# EAGLE schematic M182B (EAGLE 6.6.0)
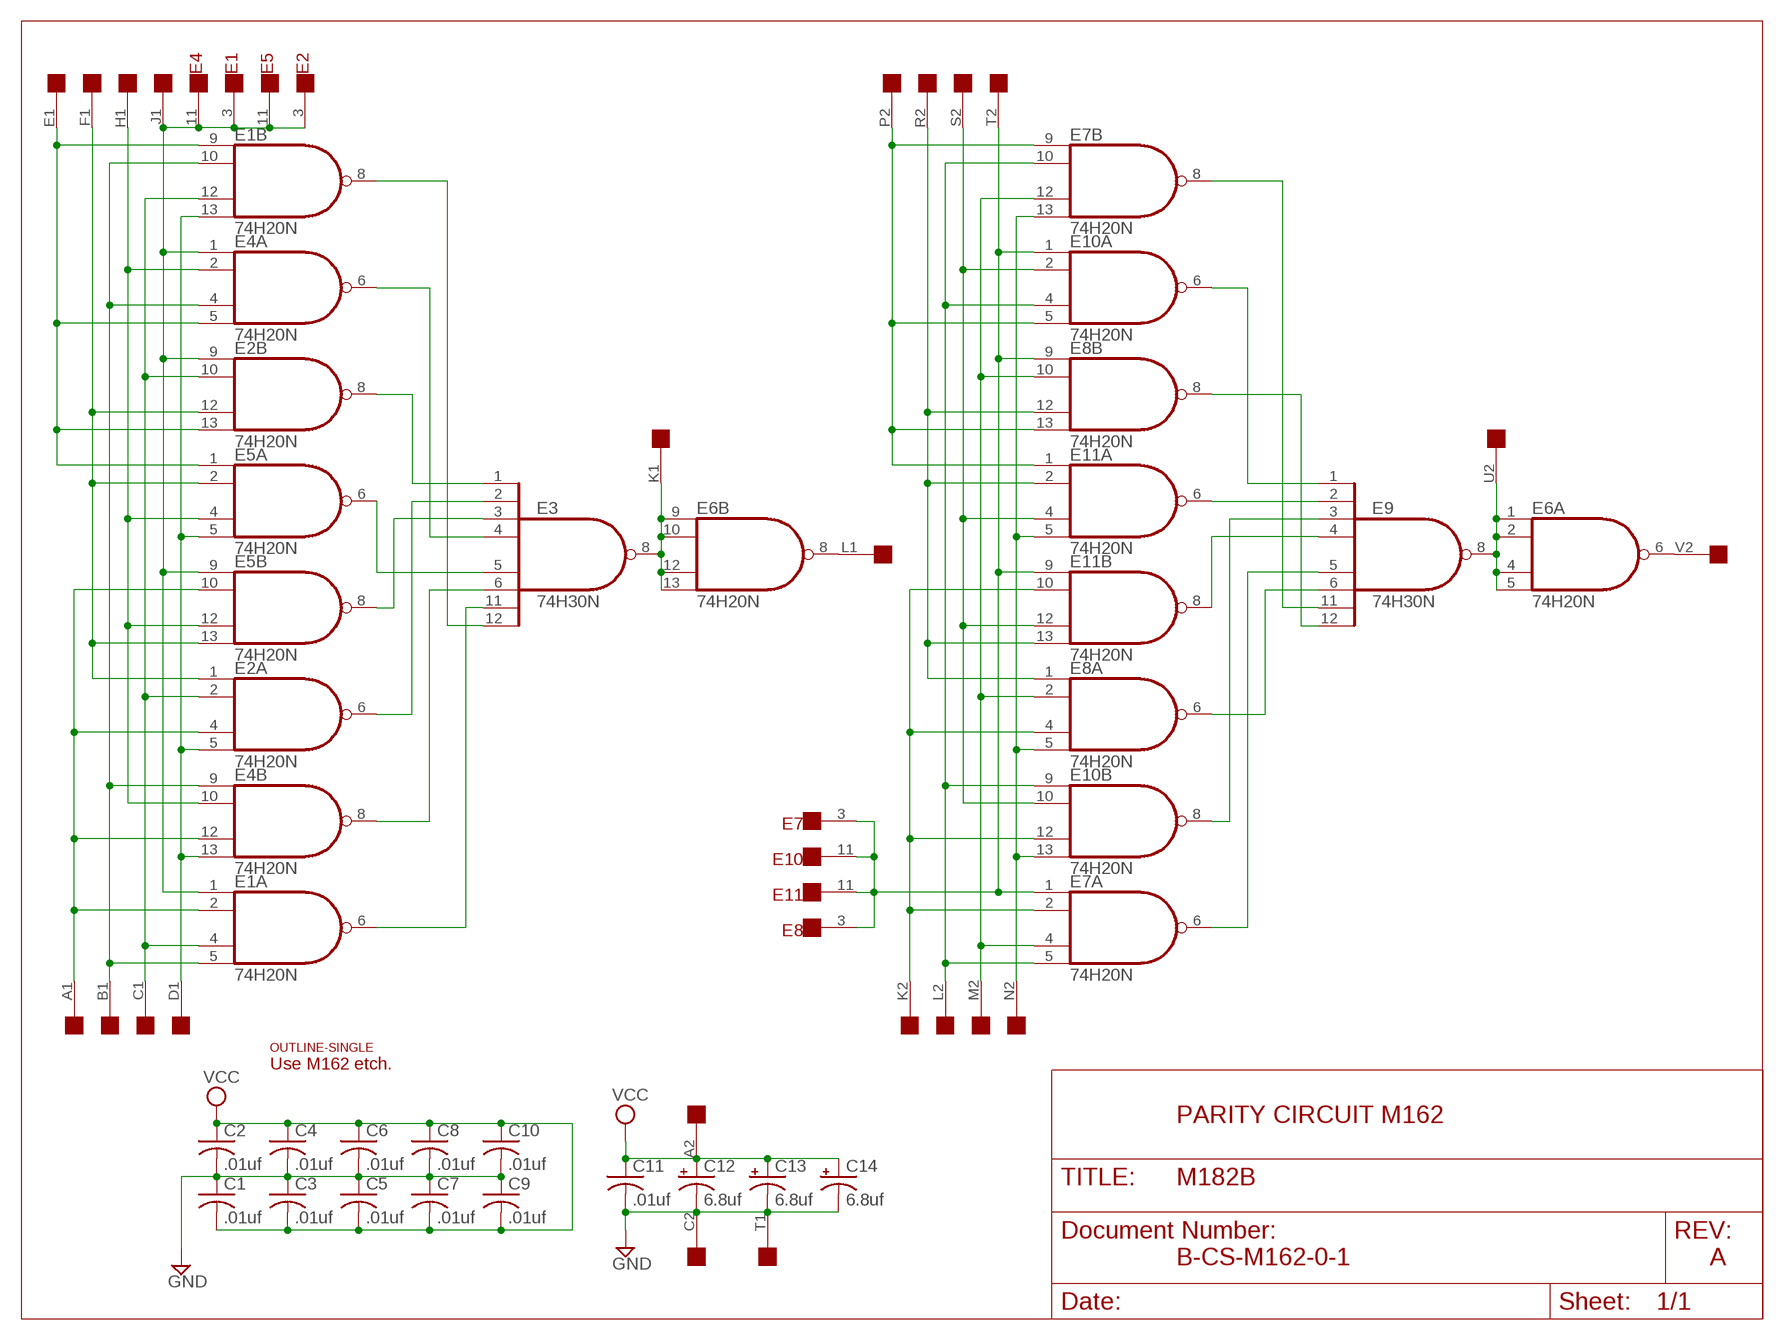
[diagram p0: schematic, sheet 1]

## Parts
C1  .01uf  C-US050-025X075  [C050-025X075]
C2  .01uf  C-US050-025X075  [C050-025X075]
C3  .01uf  C-US050-025X075  [C050-025X075]
C4  .01uf  C-US050-025X075  [C050-025X075]
C5  .01uf  C-US050-025X075  [C050-025X075]
C6  .01uf  C-US050-025X075  [C050-025X075]
C7  .01uf  C-US050-025X075  [C050-025X075]
C8  .01uf  C-US050-025X075  [C050-025X075]
C9  .01uf  C-US050-025X075  [C050-025X075]
C10  .01uf  C-US050-025X075  [C050-025X075]
C11  .01uf  C-US050-025X075  [C050-025X075]
C12  6.8uf  CPOL-USE15-5AXIAL  [E15-5]
C13  6.8uf  CPOL-USE15-5AXIAL  [E15-5]
C14  6.8uf  CPOL-USE15-5AXIAL  [E15-5]
E1  74H20N  74S20N  [DIL14]
E2  74H20N  74S20N  [DIL14]
E3  74H30N  7430N  [DIL14]
E4  74H20N  74S20N  [DIL14]
E5  74H20N  74S20N  [DIL14]
E6  74H20N  74S20N  [DIL14]
E7  74H20N  74S20N  [DIL14]
E8  74H20N  74S20N  [DIL14]
E9  74H30N  7430N  [DIL14]
E10  74H20N  74S20N  [DIL14]
E11  74H20N  74S20N  [DIL14]
U$1  OUTLINE-SINGLE  [SINGLE]
U$2  EDGE-2CONNECTOR  [EDGE-CON2]

## Nets
GND [Supply]: C1.1 C2.2 C3.1 C4.2 C5.1 C6.2 C7.1 C8.2 C9.1 C10.2 C11.2 C12.- C13.- C14.- U$2.C2 U$2.T1
N$1: E1.2(A:I1) E2.4(A:I2) E4.12(B:I2) E5.10(B:I1) U$2.A1
N$2: E1.13(B:I3) E2.5(A:I3) E4.13(B:I3) E5.5(A:I3) U$2.D1
N$3: E1.1(A:I0) E1.3(3:NC) E2.3(3:NC) E2.9(B:I0) E4.1(A:I0) E4.11(11:NC) E5.9(B:I0) E5.11(11:NC) U$2.J1
N$4: E4.2(A:I1) E4.10(B:I1) E5.4(A:I2) E5.12(B:I2) U$2.H1
N$5: E1.4(A:I2) E1.12(B:I2) E2.2(A:I1) E2.10(B:I1) U$2.C1
N$6: E1.5(A:I3) E1.10(B:I1) E4.4(A:I2) E4.9(B:I0) U$2.B1
N$7: E2.1(A:I0) E2.12(B:I2) E5.2(A:I1) E5.13(B:I3) U$2.F1
N$8: E1.9(B:I0) E2.13(B:I3) E4.5(A:I3) E5.1(A:I0) U$2.E1
N$9: E1.8(B:O) E3.12(I7)
N$10: E3.4(I3) E4.6(A:O)
N$11: E2.8(B:O) E3.1(I0)
N$12: E3.5(I4) E5.6(A:O)
N$13: E3.3(I2) E5.8(B:O)
N$14: E2.6(A:O) E3.2(I1)
N$15: E1.6(A:O) E3.11(I6)
N$16: E3.6(I5) E4.8(B:O)
N$17: E3.8(O) E6.9(B:I0) E6.10(B:I1) E6.12(B:I2) E6.13(B:I3) U$2.K1
N$18: E7.2(A:I1) E8.4(A:I2) E10.12(B:I2) E11.10(B:I1) U$2.K2
N$19: E7.13(B:I3) E8.5(A:I3) E10.13(B:I3) E11.5(A:I3) U$2.N2
N$20: E7.1(A:I0) E7.3(3:NC) E8.3(3:NC) E8.9(B:I0) E10.1(A:I0) E10.11(11:NC) E11.9(B:I0) E11.11(11:NC) U$2.T2
N$21: E10.2(A:I1) E10.10(B:I1) E11.4(A:I2) E11.12(B:I2) U$2.S2
N$22: E7.4(A:I2) E7.12(B:I2) E8.2(A:I1) E8.10(B:I1) U$2.M2
N$23: E7.5(A:I3) E7.10(B:I1) E10.4(A:I2) E10.9(B:I0) U$2.L2
N$24: E8.1(A:I0) E8.12(B:I2) E11.2(A:I1) E11.13(B:I3) U$2.R2
N$25: E7.9(B:I0) E8.13(B:I3) E10.5(A:I3) E11.1(A:I0) U$2.P2
N$26: E7.8(B:O) E9.11(I6)
N$27: E9.1(I0) E10.6(A:O)
N$28: E8.8(B:O) E9.12(I7)
N$29: E9.2(I1) E11.6(A:O)
N$30: E9.4(I3) E11.8(B:O)
N$31: E8.6(A:O) E9.6(I5)
N$32: E7.6(A:O) E9.5(I4)
N$33: E9.3(I2) E10.8(B:O)
N$34: E6.1(A:I0) E6.2(A:I1) E6.4(A:I2) E6.5(A:I3) E9.8(O) U$2.U2
N$35: E6.6(A:O) U$2.V2
N$36: E6.8(B:O) U$2.L1
VCC [Supply]: C1.2 C2.1 C3.2 C4.1 C5.2 C6.1 C7.2 C8.1 C9.2 C10.1 C11.1 C12.+ C13.+ C14.+ U$2.A2
Unconnected: E1.11(11:NC) E2.11(11:NC) E4.3(3:NC) E5.3(3:NC) E6.3(3:NC) E6.11(11:NC) E7.11(11:NC) E8.11(11:NC) E10.3(3:NC) E11.3(3:NC) U$2.B2 U$2.D2 U$2.E2 U$2.F2 U$2.H2 U$2.J2 U$2.M1 U$2.N1 U$2.P1 U$2.R1 U$2.S1 U$2.U1 U$2.V1

## Notes on the sheet
- Use M162 etch.
- PARITY CIRCUIT M162
- B-CS-M162-0-1 | A

## Power pins joined to a net without a drawn wire
GND: E1.7(P:GND) E2.7(P:GND) E3.7(GND) E4.7(P:GND) E5.7(P:GND) E6.7(P:GND) E7.7(P:GND) E8.7(P:GND) E9.7(GND) E10.7(P:GND) E11.7(P:GND)
VCC: E1.14(P:VCC) E2.14(P:VCC) E3.14(VCC) E4.14(P:VCC) E5.14(P:VCC) E6.14(P:VCC) E7.14(P:VCC) E8.14(P:VCC) E9.14(VCC) E10.14(P:VCC) E11.14(P:VCC)

## Library data of the parts
C1-C11 = rcl:C-US: CAPACITOR, American symbol
C12-C14 = rcl:CPOL-US: POLARIZED CAPACITOR, American symbol
E1 E2 E4-E8 E10 E11 = dec-con:74*20: Dual 4-input NAND gate
E3 E9 = 74xx-us:74*30: 8-input NAND gate
U$1 = dec-con:OUTLINE-*: Board outlines for DEC boards.
U$2 = dec-con:EDGE-2: Double-Sided DEC edge connector.

## Net classes
1 Supply: width 0.813 mm